# EAGLE design scoutmakes_robotkit (EAGLE 9.6.1)
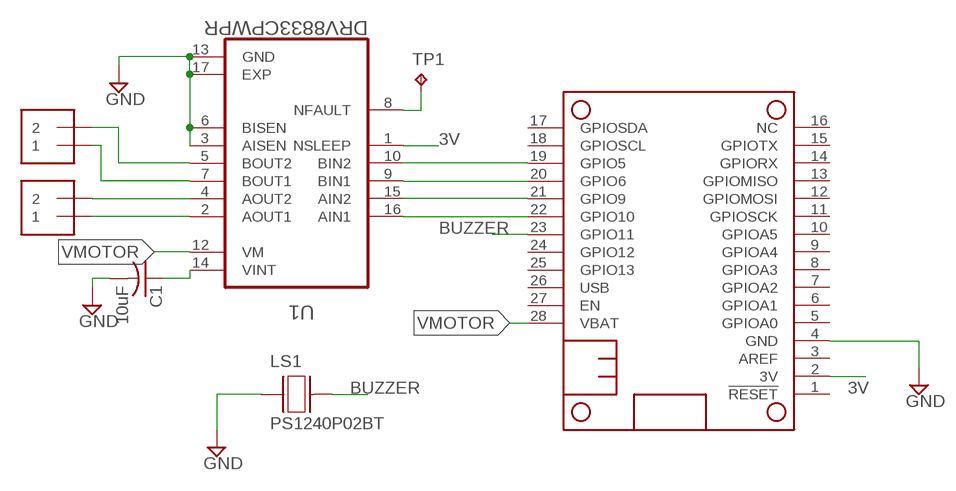
[diagram p0: schematic, sheet 1]

## Parts
C1  10uF  C-USC0805  [C0805]
J1  1X2-3.5MM  [1X2-3.5MM]
J2  1X2-3.5MM  [1X2-3.5MM]
LS1  PS1240P02BT  [XDCR_PS1240P02BT]
MS2  FEATHERWING_NODIM  [FEATHERWING_DIM]
TP1  TPTP09R  [TP09R]
U1  DRV8833CPWPR  [SOP65P640X120-17N]

## Nets
3V: MS2.2(3V) U1.1(NSLEEP)
BUZZER: LS1.2 MS2.23(GPIO11)
GND: C1.2 LS1.1 MS2.4(GND) U1.3(AISEN) U1.6(BISEN) U1.13(GND) U1.17(EXP)
N$1: J2.1 U1.2(AOUT1)
N$2: J2.2 U1.4(AOUT2)
N$3: J1.1 U1.7(BOUT1)
N$4: J1.2 U1.5(BOUT2)
N$5: MS2.19(GPIO5) U1.10(BIN2)
N$6: MS2.20(GPIO6) U1.9(BIN1)
N$7: MS2.21(GPIO9) U1.15(AIN2)
N$8: MS2.22(GPIO10) U1.16(AIN1)
N$9: TP1.TP U1.8(NFAULT)
N$10: C1.1 U1.14(VINT)
VMOTOR: MS2.28(VBAT) U1.12(VM)
Unconnected: MS2.1(!RESET) MS2.3(AREF) MS2.5(GPIOA0) MS2.6(GPIOA1) MS2.7(GPIOA2) MS2.8(GPIOA3) MS2.9(GPIOA4) MS2.10(GPIOA5) MS2.11(GPIOSCK) MS2.12(GPIOMOSI) MS2.13(GPIOMISO) MS2.14(GPIORX) MS2.15(GPIOTX) MS2.16(NC) MS2.17(GPIOSDA) MS2.18(GPIOSCL) MS2.24(GPIO12) MS2.25(GPIO13) MS2.26(USB) MS2.27(EN)

## Library data of the parts
C1 = adafruit:C-US: CAPACITOR, American symbol
J1 J2 = adafruit:1X2: 3.5mm Terminal block http://www.ladyada.net/library/pcb/eaglelibrary.html
LS1 = PS1240P02BT- piezo_buzzer:PS1240P02BT: Buzzers Transducer, Externally Driven Piezo 3V 4kHz 60dB @ 3V, 10cm Through Hole PC Pins Buy Part <https://snapeda.com/parts/PS1240P02BT/TDK/view-part/?ref=eda>; AVAILABILITY: Good; DESCRIPTION: Buzzers Transducer, Externally Driven Piezo 3V 4kHz 60dB @ 3V, 10cm Through Hole PC Pins; DIGIKEY-PURCHASE-URL: https://snapeda.com/shop?store=DigiKey&id=4814287; MF: TDK; MOUSER-PURCHASE-URL: https://snapeda.com/shop?store=Mouser&id=4814287; MP: PS1240P02BT; PACKAGE: None; PRICE: None
MS2 = adafruit:FEATHERWING
TP1 = testpad:TP: Test pad
U1 = DRV8833CPWPR:DRV8833CPWPR: 1A Low Voltage Stepper or Single/Dual Brushed DC Motor Driver (PWM Ctrl) 16-HTSSOP -40 to 85; AVAILABILITY: Unavailable; DESCRIPTION: Motor Driver Power MOSFET PWM 16-HTSSOP; MF: Texas Instruments; MP: DRV8833CPWPR; PACKAGE: HTSSOP-16 Texas Instruments; PRICE: None

## Board
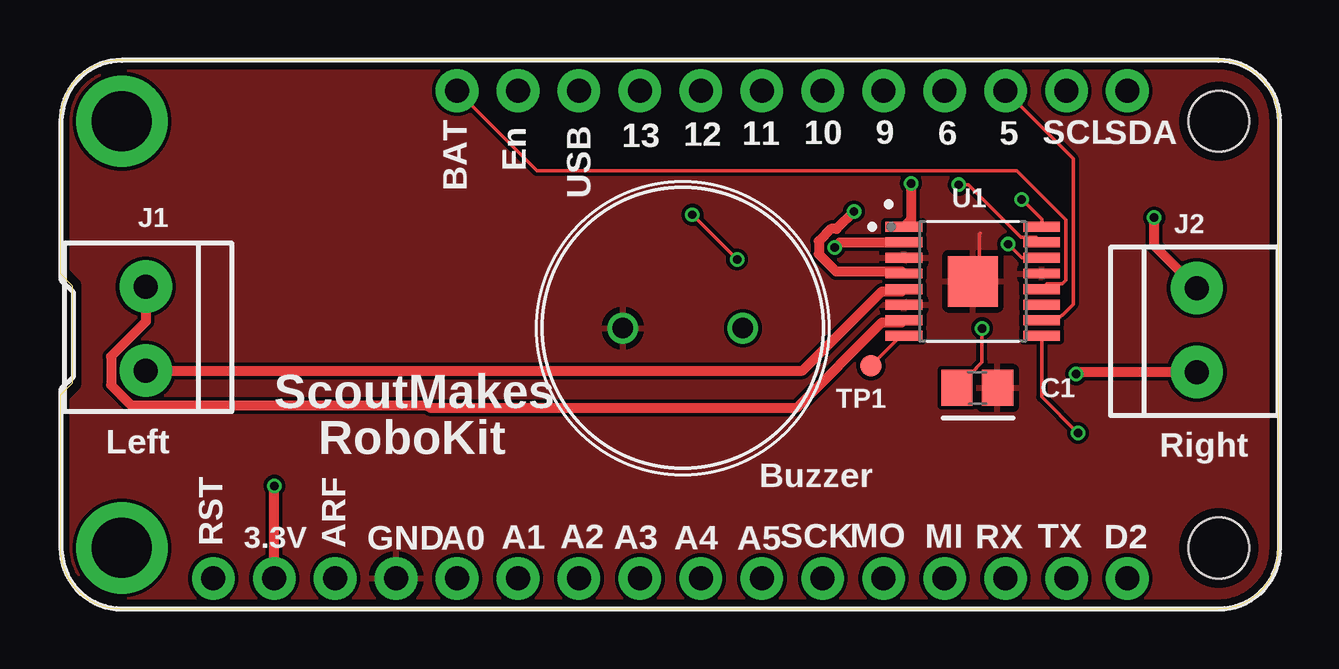
[diagram p1: board, top side]
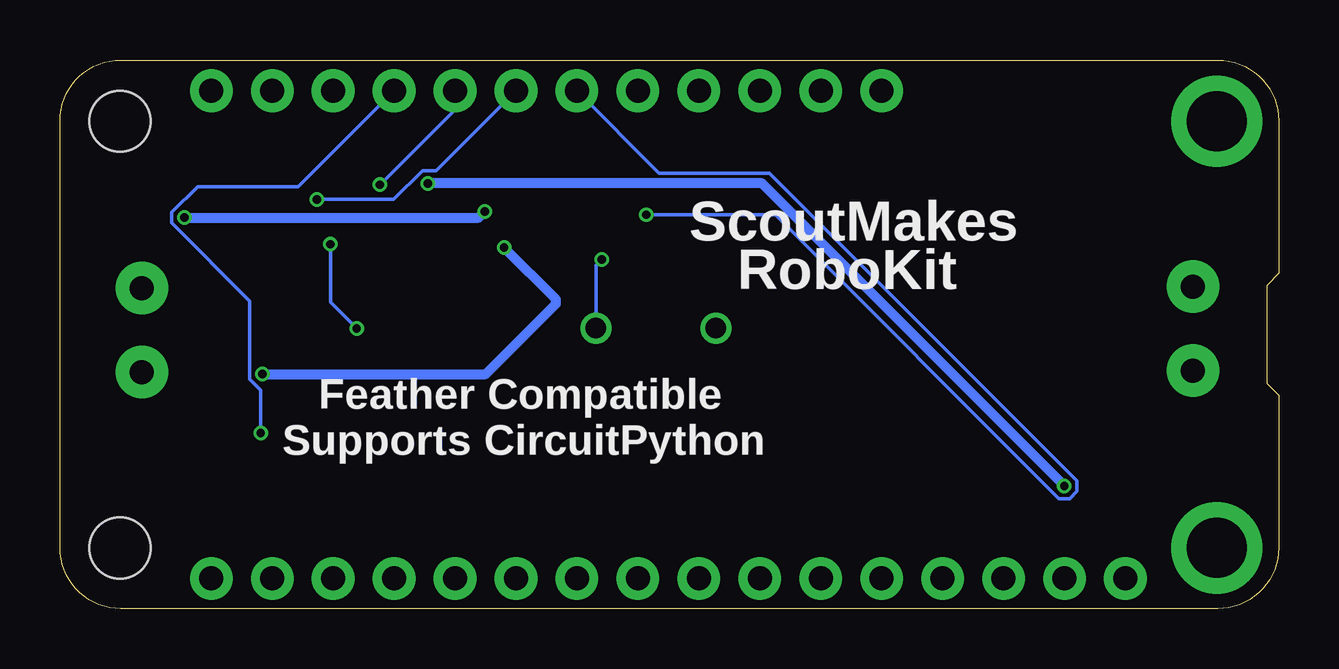
[diagram p2: board, bottom side, seen from below]

Size 50.8 x 22.86 mm. Coordinates in mm from the lower left corner, seen from the top.
Outline: 2.54,0 48.26,0 arc90 50.8,2.54 50.8,20.32 arc90 48.26,22.86 2.54,22.86 arc90 0,20.32 0,13.97 0.51,13.46 0.51,9.4 0,8.89 0,2.54 arc90 2.54,0
Copper layers (1*16): Top 0.035559375mm / dielectric 1.6mm / Bottom 0.035559375mm
Design rules "oshpark-2layer *": minimum track width 6mil, minimum drill 10mil, track to track 6mil, track to pad 6mil, pad to pad 6mil, via to via 6mil, smd to smd 6mil, copper to edge 15mil, drill to drill 6mil, minimum pad ring 5mil, minimum via ring 5mil, stop-mask expansion 2.5mil, vias tented up to drill 20mil, thermal gap 10mil

### Footprints (pad centres in the part's own frame; a part is rotated, then mirrored left to right if it is on the bottom)
C0805 = smd 1.3 x 1.5: 1 -0.85,0; 2 0.85,0
1X2-3.5MM = drill 1 pad 2.184: 1 1.8,0; 2 -1.7,0
XDCR_PS1240P02BT = drill 0.85 pad 1.28: 1 -2.5,0; 2 2.5,0
FEATHERWING_DIM = drill 1 pad 1.778: 1 6.35,1.27; 2 8.89,1.27; 3 11.43,1.27; 4 13.97,1.27; 5 16.51,1.27; 6 19.05,1.27; 7 21.59,1.27; 8 24.13,1.27; 9 26.67,1.27; 10 29.21,1.27; 11 31.75,1.27; 12 34.29,1.27; 13 36.83,1.27; 14 39.37,1.27; 15 41.91,1.27; 16 44.45,1.27; 17 44.45,21.59; 18 41.91,21.59; 19 39.37,21.59; 20 36.83,21.59; 21 34.29,21.59; 22 31.75,21.59; 23 29.21,21.59; 24 26.67,21.59; 25 24.13,21.59; 26 21.59,21.59; 27 19.05,21.59; 28 16.51,21.59 | drill 2.5 pad 3.81: P$1 2.54,20.32; P$2 2.54,2.54 | hole 2.54: 48.26,20.32; 48.26,2.54
TP09R = smd 0.9 x 0.9: TP 0,0
SOP65P640X120-17N = smd 1.57 x 0.41: 1 -2.87,2.275; 2 -2.87,1.625; 3 -2.87,0.975; 4 -2.87,0.325; 5 -2.87,-0.325; 6 -2.87,-0.975; 7 -2.87,-1.625; 8 -2.87,-2.275; 9 2.87,-2.275; 10 2.87,-1.625; 11 2.87,-0.975; 12 2.87,-0.325; 13 2.87,0.325; 14 2.87,0.975; 15 2.87,1.625; 16 2.87,2.275 | smd 2.07 x 2.105: 17 0,0

### Placement (x,y rotation side)
C1  38.23,9.2 0 top
J1  3.58,11.62 90 top
J2  47.39,11.66 270 top
LS1  25.96,11.69 0 top
MS2  0.04,-0.01 0 top
TP1  33.8,10.11 0 top
U1  38.05,13.64 0 top

### Tracks (layer width: path | path; a pad name or v marks a point on that pad's centre or on a via)
3V  (via drill 0.35)
  Top 0.406: MS2.2 v8.93,5.11 v8.94,5.12 | v35.47,17.72 35.47,16.21 U1.1
  Bottom 0.406: v8.94,5.12 21.54,17.72 v35.47,17.72
BUZZER  (via drill 0.35)
  Top 0.152: v28.22,14.55 v26.36,16.41
  Bottom 0.152: LS1.2 28.46,14.31 v28.22,14.55 | MS2.23 25.82,18.15 21.22,18.15 8.41,5.34 8.41,4.9 8.72,4.59 9.16,4.59 20.98,16.41 v26.36,16.41
GND
  Top 0.152: U1.17 38.32,13.91 38.32,15.61 38.34,15.63 38.36,15.63
  pour Top: 2.58,-0.01 arc-90 0.04,2.53 0.04,20.31 arc-90 2.58,22.85 48.3,22.85 arc-90 50.84,20.31 50.84,2.53 arc-90 48.3,-0.01
N$1  (via drill 0.35)
  Top 0.406: J2.1 42.44,9.86 v42.35,9.77 | v32.29,15.05 32.51,15.26 U1.2
  Bottom 0.406: v42.35,9.77 33.06,9.77 30.13,12.7 30.13,12.89 v32.29,15.05
N$2  (via drill 0.35)
  Top 0.406: J2.2 45.61,15.13 v45.61,16.29 | v33.09,16.55 32.37,15.82 32.14,15.82 31.63,15.32 31.63,14.77 32.35,14.05 35.09,14.05 U1.4
  Bottom 0.406: v45.61,16.29 33.35,16.29 v33.09,16.55
N$3
  Top 0.406: J1.1 3.58,11.96 2.13,10.52 2.13,9.32 2.98,8.47 15.32,8.47 15.41,8.38 30.71,8.38 34.26,11.92 35.09,11.92 U1.7
N$4
  Top 0.406: U1.5 35.09,13.22 34.26,13.22 30.95,9.92 J1.2
N$5
  Top 0.152: MS2.19 42.24,18.75 42.24,12.68 41.79,12.23 41.76,12.23 41.52,11.99 40.95,11.99 U1.10
N$6  (via drill 0.35)
  Top 0.152: U1.9 40.92,8.83 v42.43,7.31
  Bottom 0.152: v42.43,7.31 42.43,9.1 42.89,9.55 42.89,12.81 46.14,16.07 46.14,16.51 45.07,17.58 40.87,17.58 MS2.20
N$7  (via drill 0.35)
  Top 0.152: U1.15 40.7,15.48 40.05,15.48 37.87,17.66 v37.46,17.66
  Bottom 0.152: v37.46,17.66 34.33,20.8 MS2.21
N$8  (via drill 0.35)
  Top 0.152: U1.16 40.92,16.22 v40.09,17.05
  Bottom 0.152: MS2.22 35.12,18.25 35.69,18.25 36.89,17.05 v40.09,17.05
N$9
  Top 0.152: TP1.TP 35.05,11.36 U1.8
N$10  (via drill 0.35)
  Top 0.152: C1.1 38.2,10.02 38.2,10.04 38.43,10.27 v38.43,11.68 | v39.52,15.18 40.09,14.61 U1.14
  Bottom 0.152: v38.43,11.68 39.52,12.77 v39.52,15.18
VMOTOR
  Top 0.152: U1.12 41.14,13.53 41.79,13.53 41.93,13.68 41.93,16.2 39.89,18.25 19.88,18.25 MS2.28

### Text on the board
_tplace: BAT | En | USB | 13 | 12 | 11 | 10 | 9 | 6 | 5 | SCL | SDA | ScoutMakes | Left | RoboKit | Right | Buzzer | SCK | MO | MI | RX | TX | D2 | RST | 3.3V | ARF | A2 | A3 | A4 | A5 | GND | A0 | A1
_bplace: ScoutMakes | RoboKit | Feather Compatible / Supports CircuitPython